# EAGLE design OSO-MISC-20-021 Loggy Board for Ring (EAGLE 9.6.2)
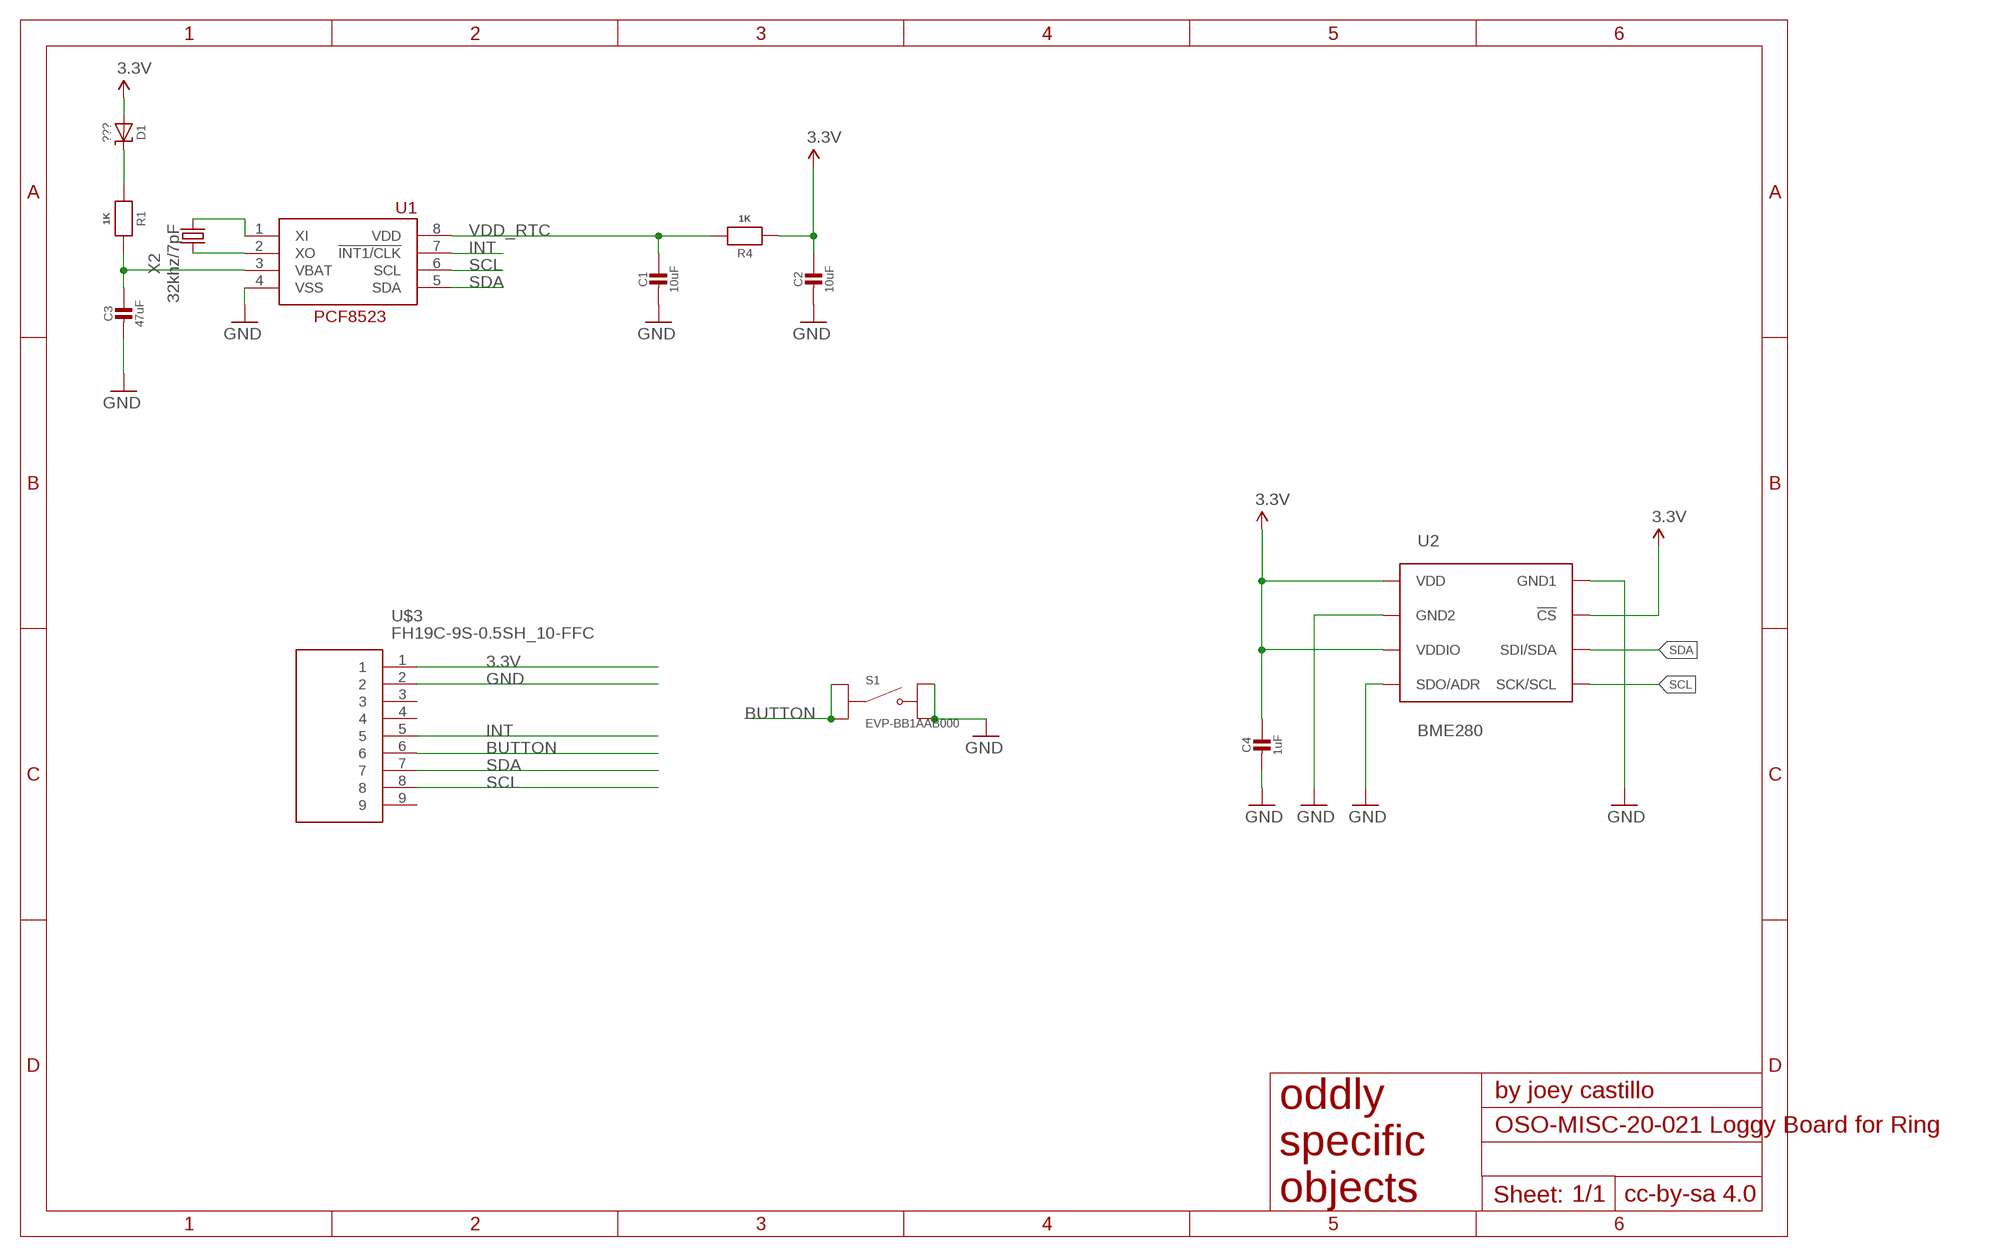
[diagram p0: schematic, sheet 1]

## Parts
C1  10uF  CAP_CERAMIC0805-NOOUTLINE  [0805-NO]
C2  10uF  CAP_CERAMIC0805-NOOUTLINE  [0805-NO]
C3  47uF  CAP_CERAMIC0805-NOOUTLINE  [0805-NO]
C4  1uF  CAP_CERAMIC_0805MP  [_0805MP]
D1  ???  DIODE-SCHOTTKYSOD-123  [SOD-123]
R1  1K  RESISTOR0805_NOOUTLINE  [0805-NO]
R4  1K  RESISTOR0805_NOOUTLINE  [0805-NO]
S1  EVP-BB1AAB000  [SW_EVP-BB1AAB000]
U1  PCF8523T  RTC_PCF8523T  [SOIC8_150MIL]
U2  BME280  [BME280_LGA]
U$3  FH19C-9S-0.5SH_10-FFC  [FH19C9S05SH10-FFC]
X2  32khz/7pF  CRYSTAL7015  [XTAL-7015]

## Nets
3.3V: C2.1 C4.1 D1.A R4.1 U2.P$2(!CS) U2.P$6(VDDIO) U2.P$8(VDD) U$3.1
BUTTON: S1.A1 S1.A2 U$3.6
GND: C1.2 C2.2 C3.2 C4.2 S1.B1 S1.B2 U1.4(VSS) U2.P$1(GND1) U2.P$5(SDO/ADR) U2.P$7(GND2) U$3.2
INT: U1.7(!INT1/CLK) U$3.5
N$1: D1.C R1.1
N$2: C3.1 R1.2 U1.3(VBAT)
N$7: U1.1(XI) X2.1
N$8: U1.2(XO) X2.4
SCL: U1.6(SCL) U2.P$4(SCK/SCL) U$3.8
SDA: U1.5(SDA) U2.P$3(SDI/SDA) U$3.7
VDD_RTC: C1.1 R4.2 U1.8(VDD)
Unconnected: U$3.3 U$3.4 U$3.9

## Library data of the parts
C1-C4 = microbuilder:CAP_CERAMIC: Ceramic Capacitors For new designs, use the packages preceded by an '_' character since they are more reliable: The following footprints should be used on most boards: _0402 - Standard footprint for regular board layouts _0603 - Standard footprint for regular board layouts _0805 - Standard footprint for regular board layouts _1206 - Standard footprint for regular board layouts For extremely tight-pitch boards where space is at a premium, the following 'micro-pitch' footprints can be used (smaller pads, no silkscreen outline, etc.): _0402MP - Micro-pitch footprint for very dense/compact boards _0603MP - Micro-pitch footprint for very dense/compact boards _0805MP - Micro-pitch footprint for very dense/compact boards _1206MP - Micro-pitch footprint for very dense/compact boards
D1 = microbuilder:DIODE-SCHOTTKY
R1 R4 = microbuilder:RESISTOR: Resistors For new designs, use the packages preceded by an '_' character since they are more reliable: The following footprints should be used on most boards: _0402 - Standard footprint for regular board layouts _0603 - Standard footprint for regular board layouts _0805 - Standard footprint for regular board layouts _1206 - Standard footprint for regular board layouts For extremely tight-pitch boards where space is at a premium, the following 'micro-pitch' footprints can be used (smaller pads, no silkscreen outline, etc.): _0402MP - Micro-pitch footprint for very dense/compact boards _0603MP - Micro-pitch footprint for very dense/compact boards _0805MP - Micro-pitch footprint for very dense/compact boards _1206MP - Micro-pitch footprint for very dense/compact boards
S1 = EVP-BB1AAB000:EVP-BB1AAB000: SWITCH TACTILE SPST-NO 0.02A 15V; DESCRIPTION: Tactile Switch SPST-NO Top Actuated Surface Mount; DIGI-KEY_PART_NUMBER: P124390CT-ND; MF: Panasonic Electronic Components; MP: EVP-BB1AAB000; PACKAGE: None; PURCHASE-URL: https://pricing.snapeda.com/search/part/EVP-BB1AAB000/?ref=eda
U1 = microbuilder:RTC_PCF8523
U2 = BME280ComponentLibrary:BME280; PROD_ID: IC-13090
U$3 = FH19C-9S-0.5SH:FH19C-9S-0.5SH_10-FFC
X2 = My Stuff:CRYSTAL: CRYSTAL

## Net classes
1 power: width 0.305 mm

## Board
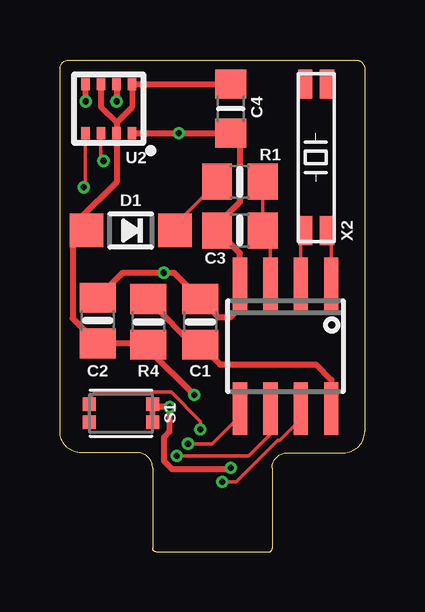
[diagram p1: board, top side]
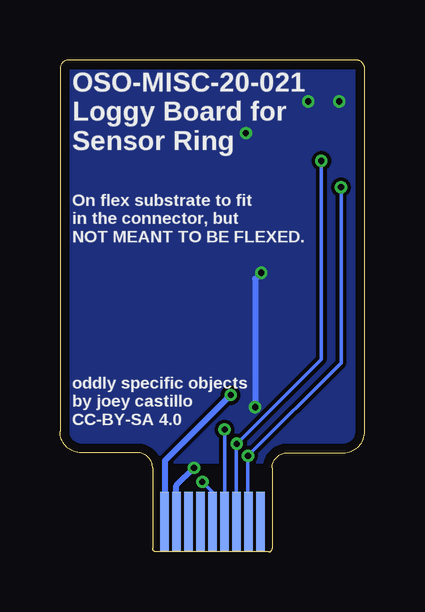
[diagram p2: board, bottom side, seen from below]

Size 12.7 x 20.52 mm. Coordinates in mm from the lower left corner, seen from the top.
Outline: 3.86,3.5 arc90 3.23,4.14 0.89,4.14 arc-90 0,5.02 0,20.14 arc-90 0.38,20.52 12.32,20.52 arc-90 12.7,20.14 12.7,5.02 arc-90 11.81,4.14 9.47,4.14 arc90 8.84,3.5
Copper layers (1*16): Top 0.035559375mm / dielectric 4mil / Bottom 0.035559375mm
Design rules "oshpark-2layer *": minimum track width 6mil, minimum drill 10mil, track to track 6mil, track to pad 6mil, pad to pad 6mil, via to via 6mil, smd to smd 6mil, copper to edge 15mil, drill to drill 6mil, minimum pad ring 5mil, minimum via ring 5mil, stop-mask expansion 2.5mil, vias tented up to drill 12mil, thermal gap 10mil

### Footprints (pad centres in the part's own frame; a part is rotated, then mirrored left to right if it is on the bottom)
0805-NO = smd 1.24 x 1.5: 1 -0.95,0; 2 0.95,0
_0805MP = smd 1.2 x 1.3: 1 -1.016,0; 2 1.016,0
SOD-123 = smd 1.4 x 1.4: A 1.85,0; C -1.85,0
SW_EVP-BB1AAB000 = smd 0.55 x 0.55: A1 -1.325,0.375; A2 -1.325,-0.375; B1 1.325,0.375; B2 1.325,-0.375
SOIC8_150MIL = smd 0.6 x 2.2: 1 -1.905,-2.6; 2 -0.635,-2.6; 3 0.635,-2.6; 4 1.905,-2.6; 5 1.905,2.6; 6 0.635,2.6; 7 -0.635,2.6; 8 -1.905,2.6
BME280_LGA = smd 0.5 x 0.35: P$1 1.025,0.975; P$2 1.025,0.325; P$3 1.025,-0.325; P$4 1.025,-0.975; P$5 -1.025,-0.975; P$6 -1.025,-0.325; P$7 -1.025,0.325; P$8 -1.025,0.975
FH19C9S05SH10-FFC = smd 0.347 x 2.5 bottom: 1 2,-2.25; 2 1.5,-2.25; 3 1,-2.25; 4 0.5,-2.25; 5 0,-2.25; 6 -0.5,-2.25; 7 -1,-2.25; 8 -1.5,-2.25; 9 -2,-2.25
XTAL-7015 = smd 1.2 x 0.6: 1 -3.05,-0.45; 2 3.05,-0.45; 3 3.05,0.45; 4 -3.05,0.45

### Placement (x,y rotation side)
C1  5.84,9.6 90 top
C2  1.57,9.65 90 top
C3  7.49,13.41 180 top
C4  7.11,18.49 270 top
D1  2.95,13.41 180 top
R1  7.49,15.44 0 top
R4  3.68,9.6 90 top
S1  2.54,5.79 0 top
U1  9.4,8.58 180 top
U2  2.03,18.49 270 top
U$3  6.35,3.5 0 top
X2  10.67,16.45 90 top

### Tracks (layer width: path | path; a pad name or v marks a point on that pad's centre or on a via)
3.3V  (via drill 0.25)
  Top 0.254: v5.59,6.55 3.68,8.45 R4.1 3.63,8.7 C2.1 0.53,9.74 0.53,12.84 D1.A 0.84,13.66 0.84,13.91 2.36,15.43 U2.P$2 2.36,17.91 | U2.P$6 1.71,18.56 2.36,17.91 | 2.36,17.91 3.01,18.56 U2.P$8 C4.1
  Bottom 0.152: U$3.1 8.32,1.28
  Bottom 0.254: 8.32,1.28 8.32,3.81 v5.59,6.55
BUTTON  (via drill 0.25)
  Top 0.152: v5.84,5.11 5.84,5.45 4.63,6.67 1.46,6.67 1.21,6.42 S1.A1 S1.A2
  Bottom 0.152: U$3.6 5.85,2.3 5.84,2.31 v5.84,5.11
GND  (via drill 0.25)
  Top 0.203: S1.B1 3.9,6.13 3.86,6.1
  Top 0.254: U2.P$7 v2.36,18.79 | U2.P$5 1.06,18.8 v1.07,18.79 | v7.12,3.5 7.06,3.45 4.67,3.45 4.33,3.79 4.33,4.79 4.57,5.02 v4.57,6.04 3.99,6.04 3.9,6.13 | C2.2 2.62,11.64 v4.32,11.64 4.74,11.64 C1.2 6.6,9.78 7.11,9.78 7.49,10.16 U1.4 7.49,12.46 C3.2 6.54,13.65 7.5,14.61 7.5,17.08 C4.2 v4.95,17.47 U2.P$1 | S1.B2 3.86,6.1
  Bottom 0.254: U$3.2 7.85,2.77 v7.12,3.5 | v4.32,11.64 4.57,11.39 v4.57,6.04
  pour Bottom: 0,20.52 12.7,20.52 12.7,3.75 0,3.75
INT  (via drill 0.25)
  Top 0.152: v6.77,2.92 7.34,2.92 9.07,4.65 9.16,4.65 10.03,5.53 U1.7
  Bottom 0.152: U$3.5 6.35,2.5 v6.77,2.92
N$1
  Top 0.152: D1.C 4.8,13.66 6.54,15.41 R1.1
N$2
  Top 0.152: R1.2 C3.1 8.76,13.09 U1.3
N$7
  Top 0.152: X2.1 11.3,13.22 U1.1
N$8
  Top 0.152: U1.2 10.03,13.22 X2.4
SCL  (via drill 0.25)
  Top 0.152: U1.6 8.76,4.9 7.87,4.01 v4.87,4.01 | v0.99,15.21 1.06,15.28 U2.P$4
  Bottom 0.152: U$3.8 4.87,1.27 v4.87,4.01 0.99,7.89 v0.99,15.21
SDA  (via drill 0.25)
  Top 0.152: U1.5 7.49,5.66 6.35,4.52 v5.33,4.52 | U2.P$3 1.71,16.42 v1.81,16.31
  Bottom 0.152: U$3.7 5.35,4.5 v5.33,4.52 1.81,8.04 v1.81,16.31
VDD_RTC
  Top 0.254: R4.2 3.94,10.29 3.94,10.28 5.48,8.65 C1.1 6.67,7.82 10.67,7.82 11.3,7.18 U1.8

### Text on the board
bPlace: OSO-MISC-20-021 / Loggy Board for / Sensor Ring | On flex substrate to fit / in the connector, but / NOT MEANT TO BE FLEXED. | oddly specific objects / by joey castillo / CC-BY-SA 4.0